# EAGLE design rev_1_3 (EAGLE 7.6.0)
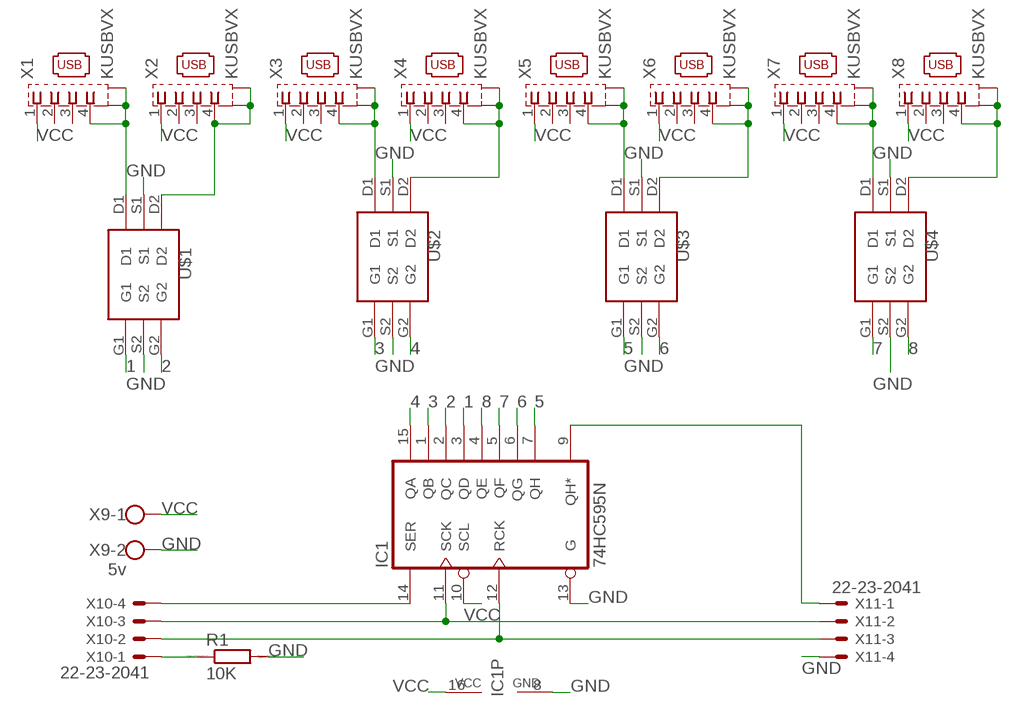
[diagram p0: schematic, sheet 1]

## Parts
IC1  74HC595N  [DIL16]
R1  10K  R0204/7  [0204/7]
U$1  FDC6305N  [FDC6305]
U$2  FDC6305N  [FDC6305]
U$3  FDC6305N  [FDC6305]
U$4  FDC6305N  [FDC6305]
X1  KUSBVX  [KUSBVX]
X2  KUSBVX  [KUSBVX]
X3  KUSBVX  [KUSBVX]
X4  KUSBVX  [KUSBVX]
X5  KUSBVX  [KUSBVX]
X6  KUSBVX  [KUSBVX]
X7  KUSBVX  [KUSBVX]
X8  KUSBVX  [KUSBVX]
X9  5v  W237-102  [W237-102]
X10  22-23-2041  [22-23-2041]
X11  22-23-2041  [22-23-2041]

## Nets
1: IC1.3(QD) U$1.G1
2: IC1.2(QC) U$1.G2
3: IC1.1(QB) U$2.G1
4: IC1.15(QA) U$2.G2
5: IC1.7(QH) U$3.G1
6: IC1.6(QG) U$3.G2
7: IC1.5(QF) U$4.G1
8: IC1.4(QE) U$4.G2
GND: IC1.8(GND) IC1.13(G) R1.2 U$1.S1 U$1.S2 U$2.S1 U$2.S2 U$3.S1 U$3.S2 U$4.S1 U$4.S2 X9.2 X11.4
N$9: U$1.D1 X1.4 X1.M1(S1) X1.M2(S2)
N$10: U$1.D2 X2.4 X2.M1(S1) X2.M2(S2)
N$11: U$2.D1 X3.4 X3.M1(S1) X3.M2(S2)
N$12: U$2.D2 X4.4 X4.M1(S1) X4.M2(S2)
N$13: U$3.D1 X5.4 X5.M1(S1) X5.M2(S2)
N$14: U$3.D2 X6.4 X6.M1(S1) X6.M2(S2)
N$15: U$4.D1 X7.4 X7.M1(S1) X7.M2(S2)
N$16: U$4.D2 X8.4 X8.M1(S1) X8.M2(S2)
N$17: R1.1 X10.1
N$19: IC1.9(QH*) X11.1
N$20: IC1.14(SER) X10.4
N$22: IC1.11(SCK) X10.3 X11.2
N$23: IC1.12(RCK) X10.2 X11.3
VCC: IC1.10(SCL) IC1.16(VCC) X1.1 X2.1 X3.1 X4.1 X5.1 X6.1 X7.1 X8.1 X9.1
Unconnected: X1.2 X1.3 X2.2 X2.3 X3.2 X3.3 X4.2 X4.3 X5.2 X5.3 X6.2 X6.3 X7.2 X7.3 X8.2 X8.3

## Library data of the parts
IC1 = 74xx-eu:74*595: 8-bit SHIFT REGISTER, output latch
R1 = eagle-ltspice:R: RESISTOR, European symbol; SPICEMODEL: NONE; SPICEPREFIX: R
U$1-U$4 = FDC6305N:FDC6305N
X1-X8 = con-kycon:KUSBVX: Vertical,Top Entry Universal Serial Bus Connector KUSBVX Series Source: KYCON Sibalco USB vertical socket KUSBV.pdf
X9 = con-wago-500:W237-102: WAGO SCREW CLAMP; MPN: 237-102; OC_FARNELL: unknown; OC_NEWARK: 70K9898
X10 X11 = con-molex:22-23-2041: .100" (2.54mm) Center Header - 4 Pin; MF: MOLEX; MPN: 22-23-2041; OC_FARNELL: 1462920; OC_NEWARK: 38C0355

## Board
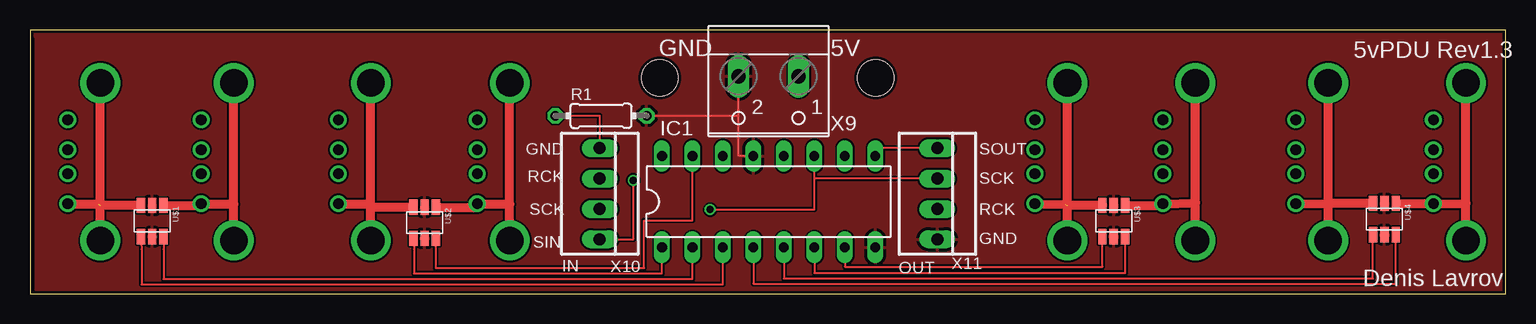
[diagram p1: board, top side]
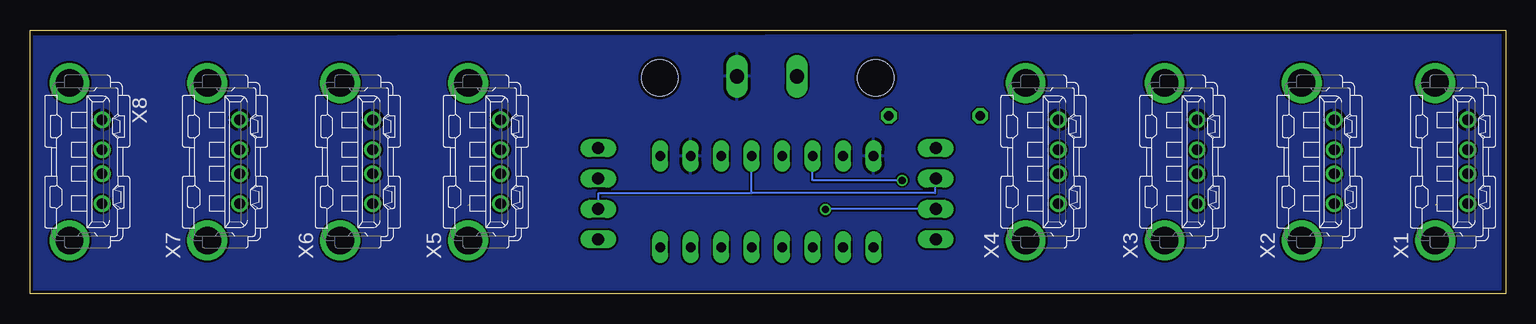
[diagram p2: board, bottom side, seen from below]

Size 123 x 22 mm. Coordinates in mm from the lower left corner, seen from the top.
Outline: 0,0 123,0 123,22 0,22 0,0
Copper layers (1*16): Top 0.035mm / dielectric 1.5mm / Bottom 0.035mm
Design rules "SeeedStudio_2layer_DRU_no_angle_20140221": minimum track width 6mil, minimum drill 12mil, track to track 6mil, track to pad 6mil, pad to pad 6mil, via to via 6mil, smd to smd 0mil, copper to edge 10mil, drill to drill 10mil, minimum pad ring 10mil, minimum via ring 6mil, stop-mask expansion 2mil, vias tented up to drill 100mil, thermal gap 10mil
Holes 3 mm at 70.5,18 52.5,18

### Footprints (pad centres in the part's own frame; a part is rotated, then mirrored left to right if it is on the bottom)
DIL16 = drill 0.813 long: 1 -8.89,-3.81; 2 -6.35,-3.81; 3 -3.81,-3.81; 4 -1.27,-3.81; 5 1.27,-3.81; 6 3.81,-3.81; 7 6.35,-3.81; 8 8.89,-3.81; 9 8.89,3.81; 10 6.35,3.81; 11 3.81,3.81; 12 1.27,3.81; 13 -1.27,3.81; 14 -3.81,3.81; 15 -6.35,3.81; 16 -8.89,3.81
0204/7 = drill 0.813 octagon: 1 -3.81,0; 2 3.81,0
FDC6305 = smd 1.27 x 0.7: D1 -0.4,0.55; D2 -0.4,2.45; G1 2.2,0.55; G2 2.2,2.45; S1 -0.4,1.5; S2 2.2,1.5
KUSBVX = drill 0.9 pad 1.3: 1 3.5,0; 2 1,0; 3 -1,0; 4 -3.5,0 | drill 2.3 pad 2.8: M1 -6.57,2.71; M2 6.57,2.71
W237-102 = drill 1.194 long: 1 -2.5,-1.27; 2 2.5,-1.27
22-23-2041 = drill 1 long: 1 -3.81,0; 2 -1.27,0; 3 1.27,0; 4 3.81,0

### Placement (x,y rotation side)
IC1  61.57,7.67 0 top
R1  47.6,14.83 0 top
U$1  8.69,6.96 270 top
U$2  31.39,6.81 270 top
U$3  88.85,6.96 270 top
U$4  111.4,7.11 270 top
X1  3.15,11 90 bottom
X2  14.27,11 90 bottom
X3  25.7,11 90 bottom
X4  37.29,11 90 bottom
X5  83.77,11 90 bottom
X6  94.44,11 90 bottom
X7  105.51,11 90 bottom
X8  116.99,11 90 bottom
X9  61.57,16.87 180 top
X10  47.5,8.33 270 top
X11  75.64,8.33 270 top

### Tracks (layer width: path | path; a pad name or v marks a point on that pad's centre or on a via)
1
  Top 0.152: U$1.G1 9.3,3.69 9.3,0.76 57.76,0.76 IC1.3
2
  Top 0.152: U$1.G2 11.12,3.69 11.12,1.22 55.22,1.22 IC1.2
3
  Top 0.152: U$2.G1 32,3.69 32,1.68 52.68,1.68 IC1.1
4
  Top 0.152: U$2.G2 33.83,3.69 33.83,2.13 51.21,2.13 51.21,6.1 55.22,6.1 IC1.15
5
  Top 0.152: IC1.7 67.92,2.23 89.4,2.23 U$3.G1
6
  Top 0.152: IC1.6 65.38,1.73 91.3,1.73 U$3.G2
7
  Top 0.152: IC1.5 62.84,1.27 111.95,1.27 U$4.G1
8
  Top 0.152: IC1.4 60.3,0.81 113.85,0.81 U$4.G2
GND
  Top 0.152: IC1.13 59.07,11.48 59.07,14.83 | 59.07,14.83 X9.2 | R1.2 59.07,14.83 | 70.46,4.52 IC1.8
  pour Top: 0.46,21.34 0.46,0.3 122.99,0.3 123,22 0,22
N$9  (1 unrouted)
  Top 0.762: X1.M1 5.86,7.36 | 5.86,7.36 X1.M2 | X1.4 5.71,7.47 | U$1.D1 5.86,7.36
N$10
  Top 0.762: X2.M1 16.98,7.47 | 16.98,7.47 X2.M2 | 16.98,7.47 X2.4 14.28,7.36 U$1.D2
N$11
  Top 0.762: X3.M1 28.41,7.21 | 28.41,7.21 28.41,7.47 | 28.41,7.47 X3.M2 | X3.4 28.41,7.47 | U$2.D1 28.41,7.21
N$12
  Top 0.762: X4.M1 40,7.47 | 40,7.47 X4.M2 | 40,7.47 X4.4 37.29,7.21 U$2.D2
N$13  (1 unrouted)
  Top 0.762: X5.M1 86.48,7.36 | 86.48,7.36 X5.M2 | X5.4 86.33,7.42 | U$3.D1 86.48,7.36
N$14
  Top 0.762: X6.M1 97.15,7.57 | 97.15,7.57 X6.M2 | 97.15,7.57 X6.4 94.28,7.36 U$3.D2
N$15
  Top 0.762: X7.M1 108.22,7.51 | 108.22,7.51 108.22,7.52 | 108.22,7.52 X7.M2 | X7.4 108.22,7.52 | U$4.D1 108.22,7.51
N$16
  Top 0.762: X8.M1 119.7,7.52 | 119.7,7.52 X8.M2 | 119.7,7.52 X8.4 116.99,7.51 U$4.D2
N$17
  Top 0.152: R1.1 47.5,14.83 X10.1
N$19
  Top 0.152: X11.1 70.46,12.14 IC1.9
N$20  (via drill 0.6)
  Top 0.152: X10.4 50.29,4.52 v50.29,9.45
  Bottom 0.152: v50.29,9.45 57.76,9.45 IC1.14
N$22  (via drill 0.6)
  Top 0.152: X11.2 65.38,9.6 | 65.38,9.6 IC1.11 | 65.38,9.6 65.38,7.01 v56.69,7.01
  Bottom 0.152: X10.3 56.69,7.06 v56.69,7.01
N$23
  Bottom 0.152: X10.2 47.55,9.6 47.55,8.38 62.84,8.38 | 62.84,8.38 IC1.12 | X11.3 75.59,7.06 75.59,8.38 62.84,8.38
VCC
  pour Bottom: 0.46,21.64 0.46,0.3 122.99,0.3 122.99,21.49

### Text on the board
tPlace: GND | 5V | 5vPDU Rev1.3 | GND | SOUT | RCK | SCK | SCK | RCK | SIN | GND | IN | OUT | Denis Lavrov